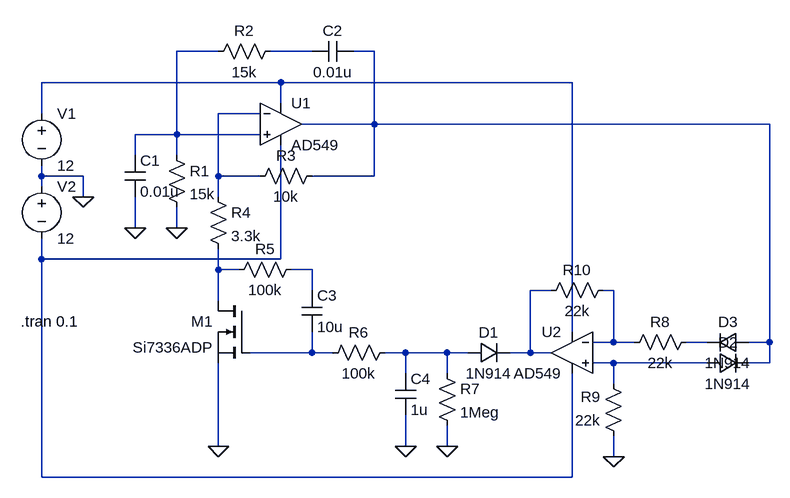
[diagram p0: schematic SineGenerator.asc]
SineGenerator.asc, the LTspice schematic file:
Version 4
SHEET 1 1032 752
WIRE 112 -16 48 -16
WIRE 256 -16 192 -16
WIRE 352 -16 320 -16
WIRE 208 32 -160 32
WIRE 656 32 208 32
WIRE 208 64 208 32
WIRE -160 80 -160 32
WIRE 176 80 112 80
WIRE 352 96 352 -16
WIRE 352 96 240 96
WIRE 960 96 352 96
WIRE 48 112 48 -16
WIRE 48 112 -16 112
WIRE 176 112 48 112
WIRE -16 144 -16 112
WIRE 48 144 48 112
WIRE -160 176 -160 160
WIRE -96 176 -160 176
WIRE 112 176 112 80
WIRE 176 176 112 176
WIRE 352 176 352 96
WIRE 352 176 256 176
WIRE -160 192 -160 176
WIRE -96 208 -96 176
WIRE 112 208 112 176
WIRE -16 256 -16 208
WIRE 48 256 48 224
WIRE -160 304 -160 272
WIRE 208 304 208 128
WIRE 208 304 -160 304
WIRE 112 320 112 288
WIRE 144 320 112 320
WIRE 256 320 224 320
WIRE 256 352 256 320
WIRE 624 352 592 352
WIRE 720 352 704 352
WIRE 112 368 112 320
WIRE 656 416 656 32
WIRE 720 432 720 352
WIRE 720 432 688 432
WIRE 752 432 720 432
WIRE 864 432 832 432
WIRE 960 432 960 96
WIRE 960 432 928 432
WIRE 256 448 256 416
WIRE 256 448 160 448
WIRE 288 448 256 448
WIRE 400 448 368 448
WIRE 464 448 400 448
WIRE 496 448 464 448
WIRE 592 448 592 352
WIRE 592 448 560 448
WIRE 624 448 592 448
WIRE 720 464 688 464
WIRE 864 464 720 464
WIRE 960 464 960 432
WIRE 960 464 928 464
WIRE 400 480 400 448
WIRE 464 480 464 448
WIRE 720 496 720 464
WIRE 112 592 112 464
WIRE 400 592 400 544
WIRE 464 592 464 560
WIRE 720 608 720 576
WIRE -160 640 -160 304
WIRE 656 640 656 480
WIRE 656 640 -160 640
FLAG 48 256 0
FLAG -96 208 0
FLAG -16 256 0
FLAG 112 592 0
FLAG 400 592 0
FLAG 464 592 0
FLAG 720 608 0
SYMBOL Opamps\\AD549 208 32 R0
SYMATTR InstName U1
SYMBOL Opamps\\AD549 656 384 M0
SYMATTR InstName U2
SYMBOL voltage -160 64 R0
WINDOW 123 0 0 Left 0
WINDOW 39 0 0 Left 0
SYMATTR InstName V1
SYMATTR Value 12
SYMBOL voltage -160 176 R0
WINDOW 123 0 0 Left 0
WINDOW 39 0 0 Left 0
SYMATTR InstName V2
SYMATTR Value 12
SYMBOL res 32 128 R0
SYMATTR InstName R1
SYMATTR Value 15k
SYMBOL cap -32 144 R0
SYMATTR InstName C1
SYMATTR Value 0.01u
SYMBOL res 208 -32 R90
WINDOW 0 0 56 VBottom 2
WINDOW 3 32 56 VTop 2
SYMATTR InstName R2
SYMATTR Value 15k
SYMBOL cap 320 -32 R90
WINDOW 0 0 32 VBottom 2
WINDOW 3 32 32 VTop 2
SYMATTR InstName C2
SYMATTR Value 0.01u
SYMBOL res 272 160 R90
WINDOW 0 0 56 VBottom 2
WINDOW 3 32 56 VTop 2
SYMATTR InstName R3
SYMATTR Value 10k
SYMBOL res 96 192 R0
SYMATTR InstName R4
SYMATTR Value 3.3k
SYMBOL res 240 304 R90
WINDOW 0 0 56 VBottom 2
WINDOW 3 32 56 VTop 2
SYMATTR InstName R5
SYMATTR Value 100k
SYMBOL res 384 432 R90
WINDOW 0 0 56 VBottom 2
WINDOW 3 32 56 VTop 2
SYMATTR InstName R6
SYMATTR Value 100k
SYMBOL cap 240 352 R0
SYMATTR InstName C3
SYMATTR Value 10u
SYMBOL res 448 464 R0
SYMATTR InstName R7
SYMATTR Value 1Meg
SYMBOL cap 384 480 R0
SYMATTR InstName C4
SYMATTR Value 1u
SYMBOL diode 496 464 R270
WINDOW 0 32 32 VTop 2
WINDOW 3 0 32 VBottom 2
SYMATTR InstName D1
SYMATTR Value 1N914
SYMBOL diode 864 480 R270
WINDOW 0 32 32 VTop 2
WINDOW 3 0 32 VBottom 2
SYMATTR InstName D2
SYMATTR Value 1N914
SYMBOL diode 928 416 R90
WINDOW 0 0 32 VBottom 2
WINDOW 3 32 32 VTop 2
SYMATTR InstName D3
SYMATTR Value 1N914
SYMBOL res 848 416 R90
WINDOW 0 0 56 VBottom 2
WINDOW 3 32 56 VTop 2
SYMATTR InstName R8
SYMATTR Value 22k
SYMBOL res 736 592 R180
WINDOW 0 36 76 Left 2
WINDOW 3 36 40 Left 2
SYMATTR InstName R9
SYMATTR Value 22k
SYMBOL res 720 336 R90
WINDOW 0 0 56 VBottom 2
WINDOW 3 32 56 VTop 2
SYMATTR InstName R10
SYMATTR Value 22k
SYMBOL nmos 160 368 M0
SYMATTR InstName M1
SYMATTR Value Si7336ADP
TEXT -192 400 Left 2 !.tran 0.1

The netlist it stands for:
* SineGenerator.asc
XU1 N001 N005 N004 N006 N003 AD549  ; pins In+ In- V+ V- OUT
XU2 N014 N010 N004 N006 N009 AD549  ; pins In+ In- V+ V- OUT
V1 N004 0 12
V2 0 N006 12
R1 N001 0 15k
C1 N001 0 0.01u
R2 N002 N001 15k
C2 N003 N002 0.01u
R3 N003 N005 10k
R4 N005 N007 3.3k
R5 N008 N007 100k
R6 N013 N012 100k
C3 N008 N012 10u
R7 N013 0 1Meg
C4 N013 0 1u
D1 N013 N009 1N914
D2 N014 N003 1N914
D3 N003 N011 1N914
R8 N011 N010 22k
R9 0 N014 22k
R10 N010 N009 22k
M1 N007 N012 0 0 Si7336ADP
.model D D
.lib standard.dio
.model NMOS NMOS
.model PMOS PMOS
.lib standard.mos
.tran 0.1
.backanno
.end